# EAGLE design 3DHover (EAGLE 9.6.2)
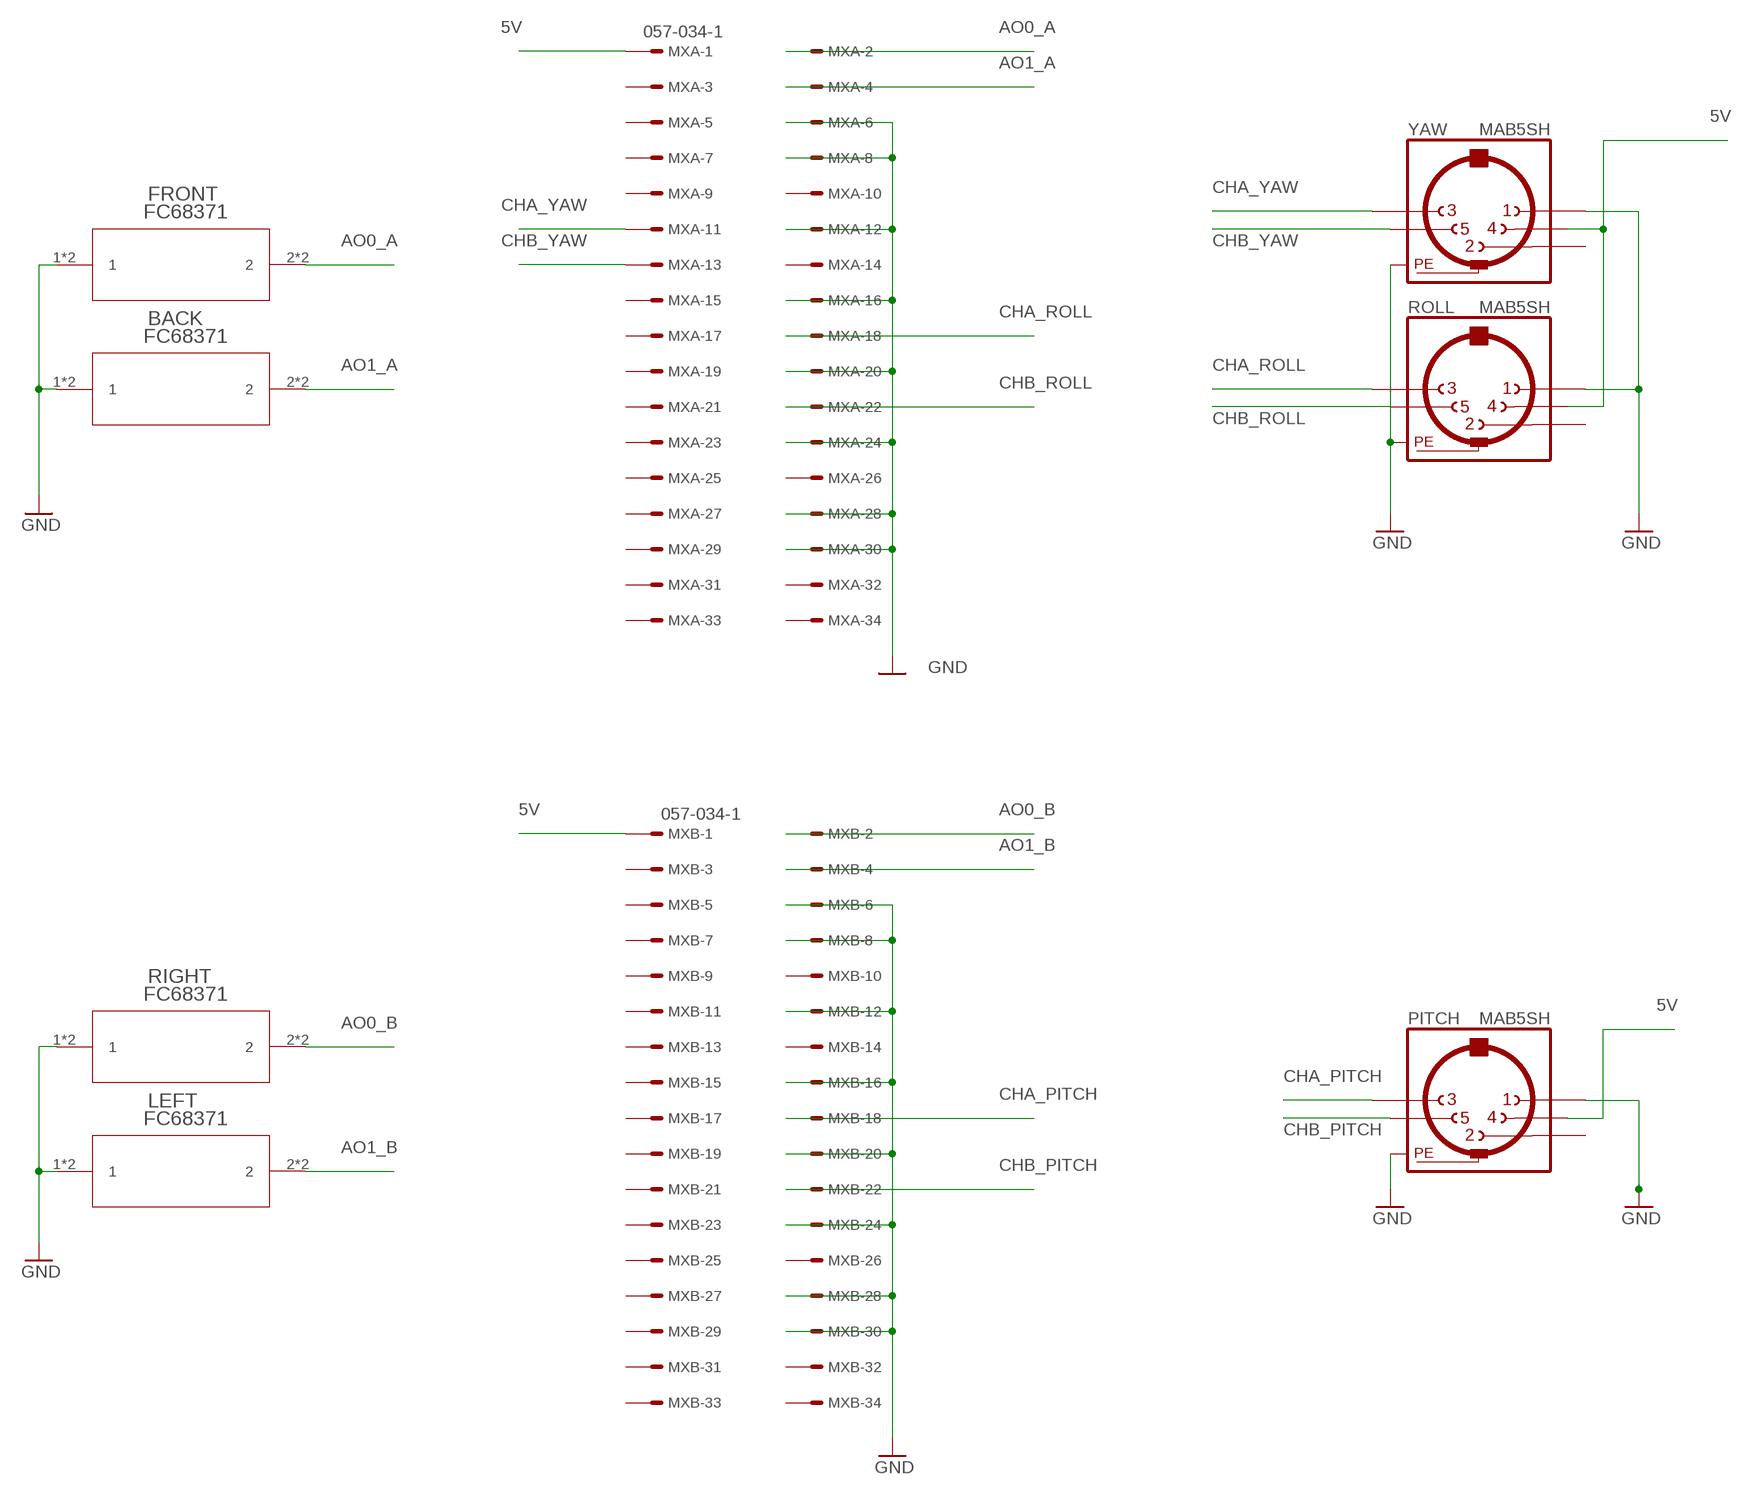
[diagram p0: schematic, sheet 1]

## Parts
BACK  FC68371  [FC68371_CLF]
FRONT  FC68371  [FC68371_CLF]
LEFT  FC68371  [FC68371_CLF]
MXA  057-034-1  [057-034-1]
MXB  057-034-1  [057-034-1]
PITCH  MAB5SH  [MAB5SH]
RIGHT  FC68371  [FC68371_CLF]
ROLL  MAB5SH  [MAB5SH]
YAW  MAB5SH  [MAB5SH]

## Nets
5V: MXA.1 MXB.1 PITCH.4 ROLL.4 YAW.4
AO0_A: FRONT.2 FRONT.4 MXA.2
AO0_B: MXB.2 RIGHT.2 RIGHT.4
AO1_A: BACK.2 BACK.4 MXA.4
AO1_B: LEFT.2 LEFT.4 MXB.4
CHA_PITCH: MXB.18 PITCH.3
CHA_ROLL: MXA.18 ROLL.3
CHA_YAW: MXA.11 YAW.3
CHB_PITCH: MXB.22 PITCH.5
CHB_ROLL: MXA.22 ROLL.5
CHB_YAW: MXA.13 YAW.5
GND: BACK.1 BACK.3 FRONT.1 FRONT.3 LEFT.1 LEFT.3 MXA.6 MXA.8 MXA.12 MXA.16 MXA.20 MXA.24 MXA.28 MXA.30 MXB.6 MXB.8 MXB.12 MXB.16 MXB.20 MXB.24 MXB.28 MXB.30 PITCH.1 PITCH.PE PITCH.PE@(PE) RIGHT.1 RIGHT.3 ROLL.1 ROLL.PE ROLL.PE@(PE) YAW.1 YAW.PE YAW.PE@(PE)
Unconnected: MXA.3 MXA.5 MXA.7 MXA.9 MXA.10 MXA.14 MXA.15 MXA.17 MXA.19 MXA.21 MXA.23 MXA.25 MXA.26 MXA.27 MXA.29 MXA.31 MXA.32 MXA.33 MXA.34 MXB.3 MXB.5 MXB.7 MXB.9 MXB.10 MXB.11 MXB.13 MXB.14 MXB.15 MXB.17 MXB.19 MXB.21 MXB.23 MXB.25 MXB.26 MXB.27 MXB.29 MXB.31 MXB.32 MXB.33 MXB.34 PITCH.2 ROLL.2 YAW.2

## Library data of the parts
BACK FRONT LEFT RIGHT = FC68371:FC68371; COPYRIGHT: Copyright (C) 2022 Ultra Librarian. All rights reserved.; MANUFACTURER_PART_NUMBER: FC68371; MFR_NAME: Cliff
MXA MXB = con-panduit:057-034-: CONNECTOR 34-pin series 057 contact pc board low profile headers; OC_FARNELL: unknown; OC_NEWARK: unknown
PITCH ROLL YAW = con-hirschmann:MAB5SH: Female CONNECTOR 5 pins 90 deg. with shield, horizontal (DIN 41524); OC_FARNELL: 809883; OC_NEWARK: unknown

## Net classes
0 default: width 0.35 mm, drill 0.5 mm, clearance 0.5 mm

## Board
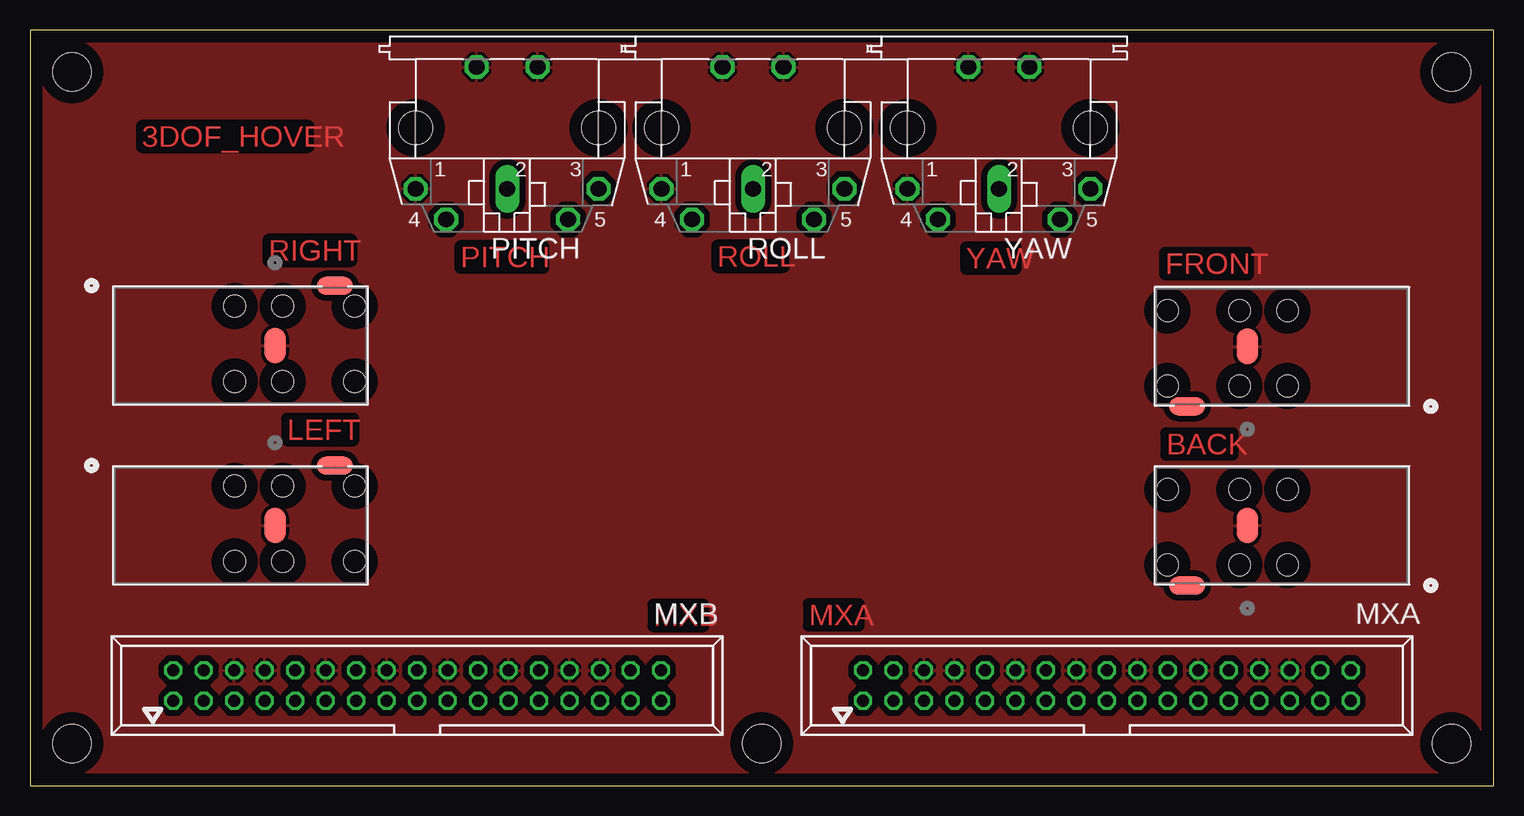
[diagram p1: board, top side]
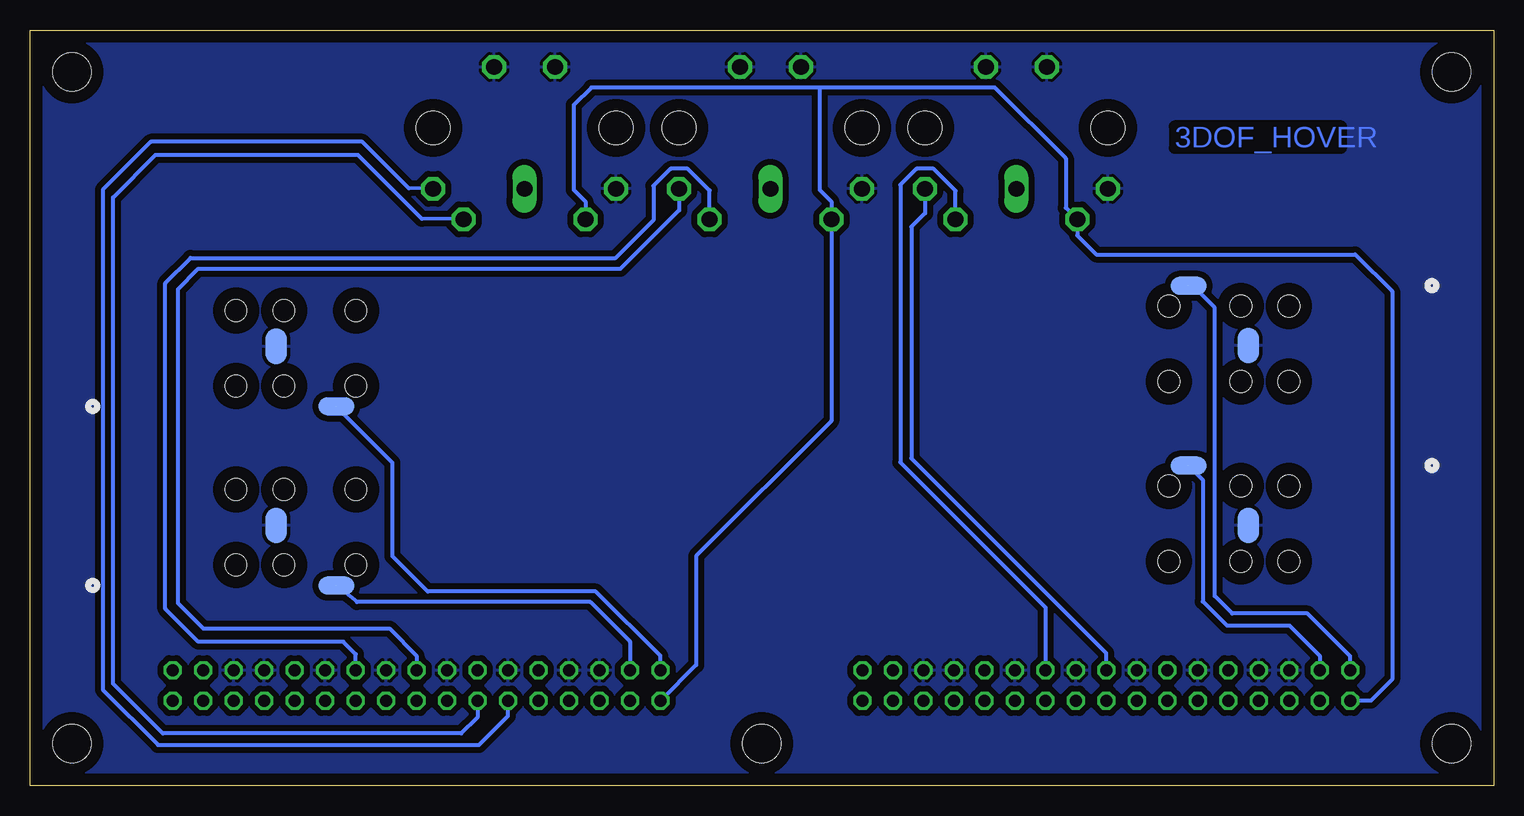
[diagram p2: board, bottom side, seen from below]

Size 122 x 63 mm. Coordinates in mm from the lower left corner, seen from the top.
Outline: 0,0 122,0 122,63 0,63 0,0
Copper layers (1*16): Top 0.035mm / dielectric 1.5mm / Bottom 0.035mm
Design rules "default": minimum track width 6mil, minimum drill 0.35mm, track to track 6mil, track to pad 6mil, pad to pad 6mil, via to via 6mil, smd to smd 6mil, copper to edge 40mil, drill to drill 6mil, minimum pad ring 10mil, minimum via ring 8mil, stop-mask expansion 4mil, vias tented up to drill 0mil, thermal gap 10mil
Holes 3.2 mm at 3.5,3.5 118.5,3.5 118.5,59.5 3.5,59.5 61,3.5

### Footprints (pad centres in the part's own frame; a part is rotated, then mirrored left to right if it is on the bottom)
FC68371_CLF = smd 1.808 x 3.008 bottom: 1 0,-5 | smd 3.008 x 1.508 bottom: 2 5,0 | smd 1.808 x 3.008: 3 0,-5 | smd 3.008 x 1.508: 4 5,0 | hole 1.8: -3.35,-1.7; 0.65,-1.7; 6.65,-1.7; -3.35,-8; 0.65,-8; 6.65,-8
057-034-1 = drill 1 octagon: 1 -20.32,-1.27; 2 -20.32,1.27; 3 -17.78,-1.27; 4 -17.78,1.27; 5 -15.24,-1.27; 6 -15.24,1.27; 7 -12.7,-1.27; 8 -12.7,1.27; 9 -10.16,-1.27; 10 -10.16,1.27; 11 -7.62,-1.27; 12 -7.62,1.27; 13 -5.08,-1.27; 14 -5.08,1.27; 15 -2.54,-1.27; 16 -2.54,1.27; 17 0,-1.27; 18 0,1.27; 19 2.54,-1.27; 20 2.54,1.27; 21 5.08,-1.27; 22 5.08,1.27; 23 7.62,-1.27; 24 7.62,1.27; 25 10.16,-1.27; 26 10.16,1.27; 27 12.7,-1.27; 28 12.7,1.27; 29 15.24,-1.27; 30 15.24,1.27; 31 17.78,-1.27; 32 17.78,1.27; 33 20.32,-1.27; 34 20.32,1.27
MAB5SH = drill 1.321 octagon: 1 7.62,5.08; 3 -7.62,5.08; 4 5.08,7.62; 5 -5.08,7.62; PE -2.54,-5.08; PE@ 2.54,-5.08 | drill 1.321 long: 2 0,5.08 | hole 2.794: 7.62,0; -7.62,0

### Placement (x,y rotation side)
BACK  101.48,16.68 180 top
FRONT  101.48,31.61 180 top
LEFT  20.42,26.68 0 top
MXA  89.77,8.33 0 top
MXB  32.27,8.33 0 top
PITCH  39.77,54.83 180 top
RIGHT  20.42,41.68 0 top
ROLL  60.27,54.83 180 top
YAW  80.77,54.83 180 top

### Tracks (layer width: path | path; a pad name or v marks a point on that pad's centre or on a via)
5V
  Bottom 0.35: MXB.1 10.22,7.07 8.46,8.85 8.46,41.22 11.52,44.28 33.12,44.28 34.69,45.86 PITCH.4 35.66,48.18 35.66,52.3 41.57,58.21 56.17,58.21 | ROLL.4 | MXA.1 66.47,10.04 66.47,19.14 55.19,30.41 ROLL.4 | 56.17,58.21 75.2,58.21 76.67,56.73 76.67,49.67 75.69,48.69 YAW.4 | ROLL.4 55.19,48.7 56.17,49.68 56.17,58.21
AO0_A  (1 unrouted)
  Bottom 0.35: MXA.2 69.45,10.8 74.83,16.18 88.83,16.18 91.77,19.12 91.77,26.91 FRONT.4
AO0_B  (1 unrouted)
  Bottom 0.35: MXB.2 11.95,10.77 15.52,14.34 21.77,14.34 23.23,15.79 23.23,39.84 25.07,41.69 RIGHT.4
AO1_A  (1 unrouted)
  Bottom 0.35: BACK.4 94.75,15.3 75.28,15.3 71.99,12.01 MXA.4
AO1_B  (1 unrouted)
  Bottom 0.35: MXB.4 14.49,10.82 17,13.34 22.22,13.34 24.23,15.34 24.23,25.49 LEFT.4
CHA_PITCH
  Bottom 0.35: PITCH.3 47.39,47.73 48.53,46.59 48.53,27.29 32.27,11.03 MXB.18
CHA_ROLL
  Bottom 0.35: ROLL.3 67.89,47.97 72.77,43.09 107.97,43.09 109.68,41.37 109.68,15.21 107.56,13.09 92.04,13.09 89.77,10.82 MXA.18
CHA_YAW
  Bottom 0.35: YAW.3 90.42,49.8 94.3,53.69 111.92,53.69 115.92,49.69 115.92,7.99 111.32,3.38 84.58,3.38 82.15,5.81 MXA.11
CHB_PITCH
  Bottom 0.35: PITCH.5 44.85,49.6 46.68,51.43 48.1,51.43 49.44,50.08 49.44,26.94 37.35,14.85 MXB.22
CHB_ROLL
  Bottom 0.35: MXA.22 94.85,10.94 95.89,11.98 107.97,11.98 110.72,14.73 110.72,41.89 108.62,43.99 73.17,43.99 70.02,47.13 70.02,50.02 68.6,51.44 67.18,51.44 65.35,49.61 ROLL.5
CHB_YAW
  Bottom 0.35: MXA.13 84.69,5.68 86.04,4.33 110.92,4.33 115.07,8.48 115.07,49.03 111.52,52.59 94.67,52.59 89.35,47.27 YAW.5
GND
  pour Bottom: -2.58,69.22 -2.58,-5.94 127.78,-5.94 127.78,69.22
  pour Top: -2.67,67.21 -2.67,-6.01 125,-6.01 125,67.32

### Text on the board
Top: 3DOF_HOVER | RIGHT | PITCH | ROLL | YAW | FRONT | LEFT | BACK | MXB | MXA
Bottom: 3DOF_HOVER